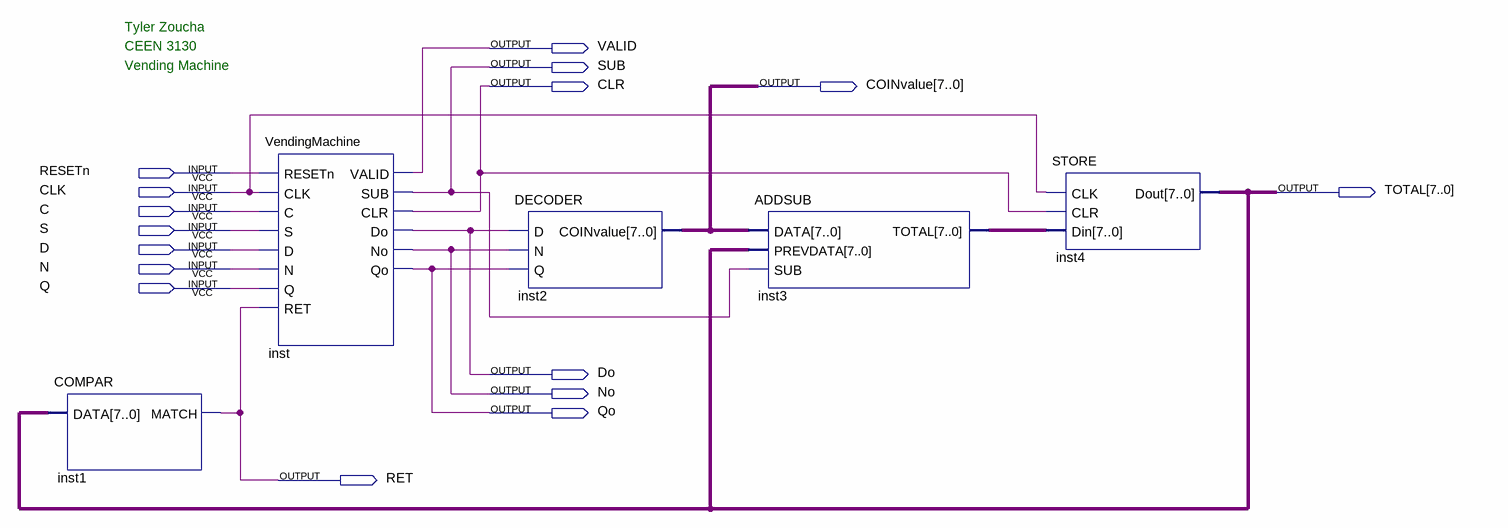
[diagram p0: schematic sheet]
// Quartus schematic Block1.bdf as structural Verilog: 5 symbols, 16 pins
module Block1 (
  input  RESETn,
  input  CLK,
  input  C,
  input  S,
  input  D,
  input  N,
  input  Q,
  output VALID,
  output SUB,
  output CLR,
  output [7:0] COINvalue,
  output [7:0] TOTAL,
  output Do,
  output No,
  output Qo,
  output RET
);

  wire [7:0] inst3_total;

  COMPAR inst1 (.DATA(TOTAL), .MATCH(RET));
  VendingMachine inst (
    .RESETn(RESETn), .CLK(CLK), .C(C), .S(S), .D(D), .N(N), .Q(Q), .RET(RET), .VALID(VALID), .SUB(SUB),
    .CLR(CLR), .Do(Do), .No(No), .Qo(Qo));
  DECODER inst2 (.D(Do), .N(No), .Q(Qo), .COINvalue(COINvalue));
  ADDSUB inst3 (.DATA(COINvalue), .PREVDATA(TOTAL), .SUB(SUB), .TOTAL(inst3_total));
  STORE inst4 (.CLK(CLK), .CLR(CLR), .Din(inst3_total), .Dout(TOTAL));

  // Notes on the sheet:
  //   Tyler Zoucha
  //   CEEN 3130
  //   Vending Machine
endmodule
